# EAGLE schematic PowerBoard (EAGLE 5.11)
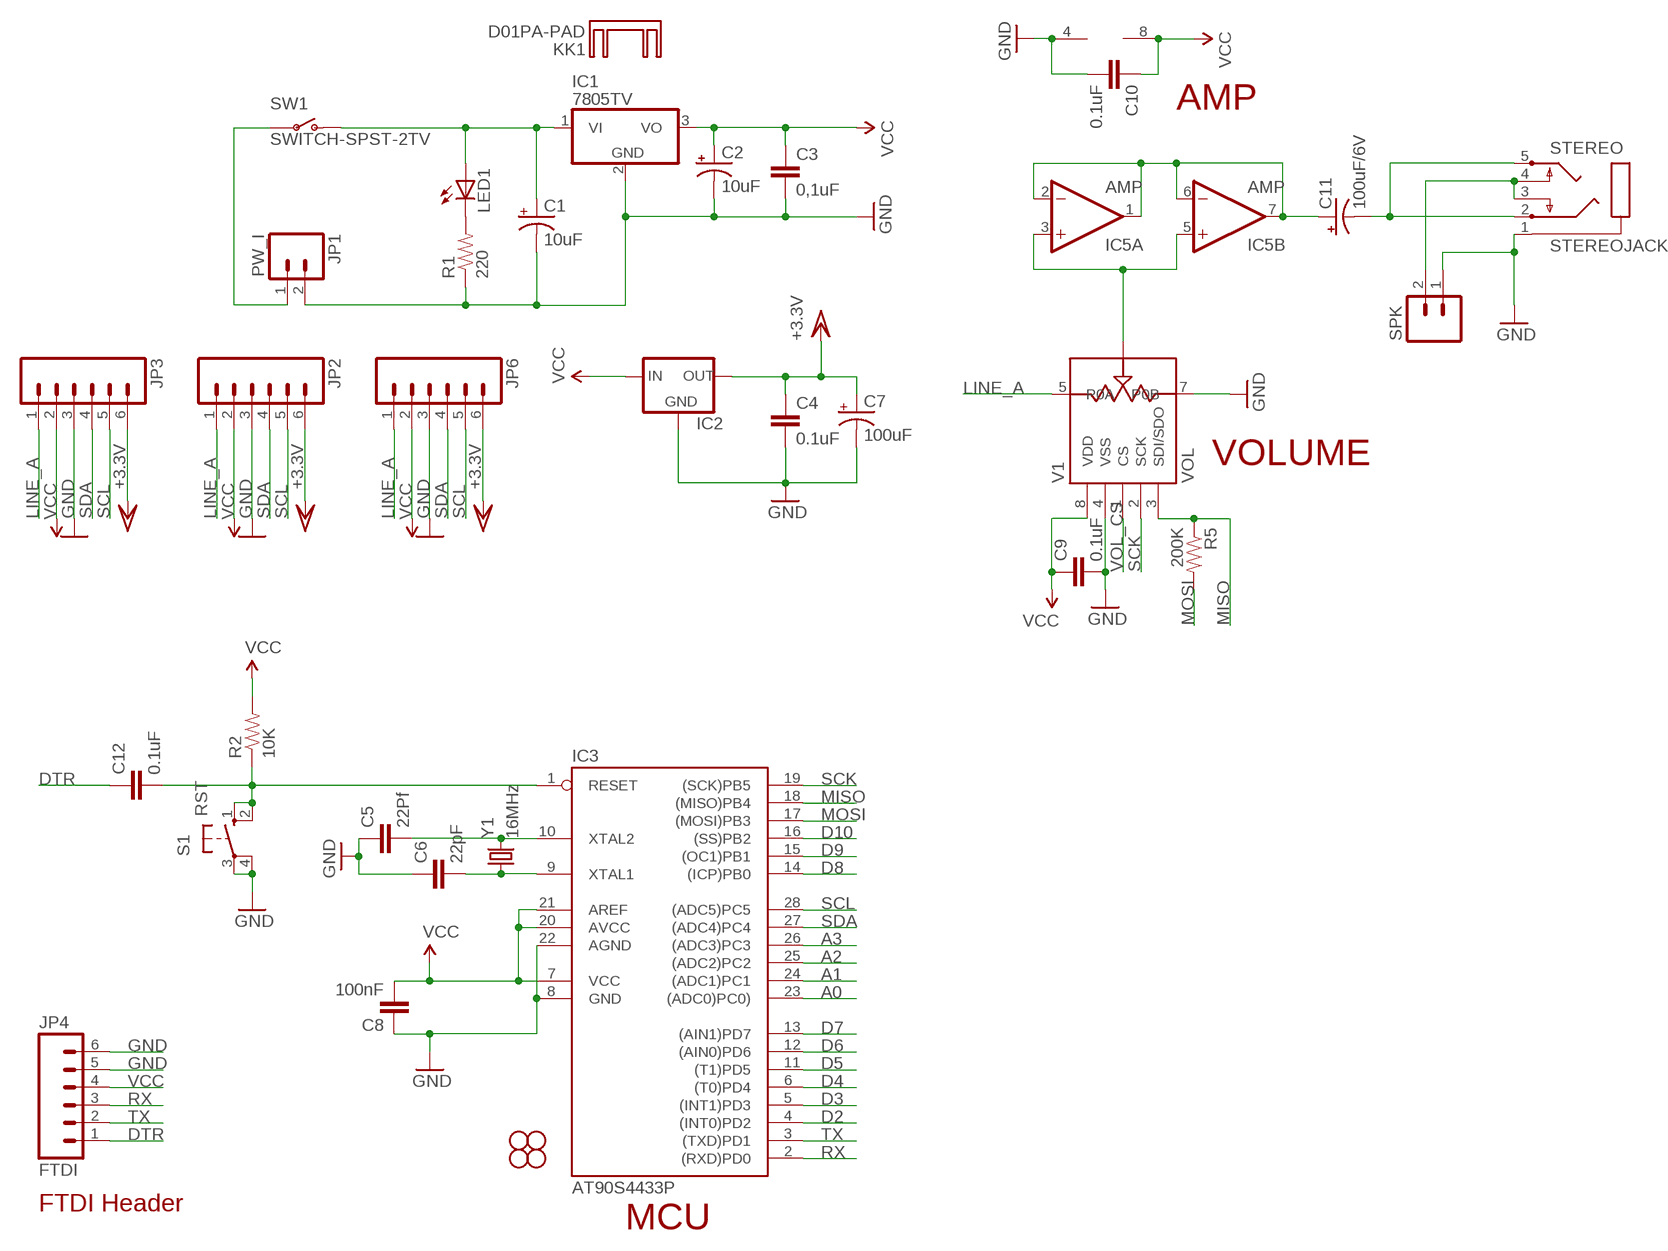
[diagram p0: schematic, sheet 1]

## Parts
C1  10uF  CAP_POLPTH2  [CPOL-RADIAL-10UF-25V]
C2  10uF  CAP_POLPTH2  [CPOL-RADIAL-10UF-25V]
C3  0,1uF  CAPPTH  [CAP-PTH-SMALL]
C4  0.1uF  CAPPTH  [CAP-PTH-SMALL]
C5  22Pf  CAPPTH  [CAP-PTH-SMALL]
C6  22pF  CAPPTH  [CAP-PTH-SMALL]
C7  100uF  CAP_POLPTH1  [CPOL-RADIAL-100UF-25V]
C8  100nF  CAPPTH  [CAP-PTH-SMALL]
C9  0.1uF  CAPPTH  [CAP-PTH-SMALL]
C10  0.1uF  CAPPTH  [CAP-PTH-SMALL]
C11  100uF/6V  CAP_POLPTH2  [CPOL-RADIAL-10UF-25V]
C12  0.1uF  CAPPTH  [CAP-PTH-SMALL]
IC1  7805TV  [TO220V]
IC2  MCP1700INLINE  [TO92-INLINE]
IC3  AT90S4433P  [DIL28-3]
IC5  AMP  TL072P  [DIL08]
JP1  PW_I  M02POLAR_LOCK  [MOLEX-1X2_LOCK]
JP2  M06POLAR_LOCK  [MOLEX-1X6_LOCK]
JP3  M06POLAR_LOCK  [MOLEX-1X6_LOCK]
JP4  FTDI  M06LOCK  [1X06_LOCK]
JP5  STAND-OFF  [STAND-OFF]
JP6  M06POLAR_LOCK  [MOLEX-1X6_LOCK]
JP7  STAND-OFF  [STAND-OFF]
JP8  STAND-OFF  [STAND-OFF]
JP9  STAND-OFF  [STAND-OFF]
KK1  D01PA-PAD  [D01PA-PAD]
LED1  LED5MM  [LED5MM]
R1  220  RESISTORPTH-1/4W  [AXIAL-0.4]
R2  10K  RESISTORPTH-1/4W  [AXIAL-0.4]
R5  200K  RESISTORPTH-1/4W  [AXIAL-0.4]
S1  RST  10-XX  [B3F-10XX]
SPK  M02POLAR  [MOLEX-1X2]
STEREO  STEREOJACK  [STX3100]
SW1  SWITCH-SPST-2TV  [SWITCH-SPST-VERTICAL]
V1  VOL  MCP416110E/P  [DIL08]
Y1  16MHz  CRYSTALHC49US  [HC49US]

## Nets
A0: IC3.23((ADC0)PC0))
A1: IC3.24((ADC1)PC1)
A2: IC3.25((ADC2)PC2)
A3: IC3.26((ADC3)PC3)
D2: IC3.4((INT0)PD2)
D3: IC3.5((INT1)PD3)
D4: IC3.6((T0)PD4)
D5: IC3.11((T1)PD5)
D6: IC3.12((AIN0)PD6)
D7: IC3.13((AIN1)PD7)
D8: IC3.14((ICP)PB0)
D9: IC3.15((OC1)PB1)
D10: IC3.16((SS)PB2)
DTR: C12.1 JP4.1
GND: C1.2(-) C2.2(-) C3.2 C4.2 C5.1 C6.1 C7.2(-) C8.1 C9.2 C10.2 IC1.2(GND) IC2.1(GND) IC3.8(GND) IC3.22(AGND) IC5.4(P:V-) JP1.2 JP2.3 JP3.3 JP4.5 JP4.6 JP6.3 R1.P$1 S1.3(P) S1.4(P1) SPK.1 STEREO.1 V1.4(VSS) V1.7(P0B)
LINE_A: JP2.1 JP3.1 JP6.1 V1.5(P0A)
MISO: IC3.18((MISO)PB4) R5.P$1 V1.3(SDI/SDO)
MOSI: IC3.17((MOSI)PB3) R5.P$2
N$1: IC5.3(A:+IN) IC5.5(B:+IN) V1.6(P0W)
N$2: C12.2 IC3.1(RESET) R2.P$1 S1.1(S) S1.2(S1)
N$3: JP1.1 SW1.2(P)
N$4: C1.1(+) IC1.1(VI) LED1.A SW1.1(O)
N$5: SPK.2 STEREO.3 STEREO.4
N$6: LED1.K(C) R1.P$2
N$8: C11.2(-) STEREO.2 STEREO.5
N$9: C11.1(+) IC5.1(A:OUT) IC5.2(A:-IN) IC5.6(B:-IN) IC5.7(B:OUT)
RX: IC3.2((RXD)PD0) JP4.3
SCK: IC3.19((SCK)PB5) V1.2(SCK)
SCL: IC3.28((ADC5)PC5) JP2.5 JP3.5 JP6.5
SDA: IC3.27((ADC4)PC4) JP2.4 JP3.4 JP6.4
TX: IC3.3((TXD)PD1) JP4.2
VCC: C2.1(+) C3.1 C8.2 C9.1 C10.1 IC1.3(VO) IC2.2(IN) IC3.7(VCC) IC3.20(AVCC) IC3.21(AREF) IC5.8(P:V+) JP2.2 JP3.2 JP4.4 JP6.2 R2.P$2 V1.8(VDD)
VCC/2: C4.1 C7.1(+) IC2.3(OUT) JP2.6 JP3.6 JP6.6 ; supply symbol labelled +3.3V
VOL_CS: V1.1(CS)
XTAL1: C6.2 IC3.9(XTAL1) Y1.1
XTAL2: C5.2 IC3.10(XTAL2) Y1.2

## Notes on the sheet
- AMP
- VOLUME
- FTDI Header
- MCU

## Library data of the parts
C1 C2 C7 C11 = SparkFun:CAP_POL: Capacitor Polarized These are standard SMD and PTH capacitors. Normally 10uF, 47uF, and 100uF in electrolytic and tantalum varieties. Always verify the external diameter of the through hole cap, it varies with capacity, voltage, and manufacturer. The EIA devices should be standard.
C3-C6 C8-C10 C12 = SparkFun:CAP: Capacitor Standard 0603 ceramic capacitor, and 0.1" leaded capacitor.
IC1 = linear:78*: Positive VOLTAGE REGULATOR Source: http://cache.national.com/ds/LM/LM78L05.pdf http://www.fairchildsemi.com/ds/LM/LM7805.pdf
IC2 = adafruit:MCP1700: VOLTAGE REGULATOR
IC3 = atmel:AT90S4433: MICROCONTROLLER 4 Kbytes FLASH 128 bytes SRAM 256 bytes EEPROM UART 6-channel 10 bit ADC; OC_FARNELL: unknown; OC_NEWARK: unknown
IC5 = linear:TL072: OP AMP
JP1 SPK = SparkFun:M02: Header 2 Standard 2-pin 0.1" header. Use with straight break away headers (SKU : PRT-00116), right angle break away headers (PRT-00553), swiss pins (PRT-00743), machine pins (PRT-00117), and female headers (PRT-00115). Molex polarized connector foot print use with SKU : PRT-08233 with associated crimp pins and housings.
JP2-JP4 JP6 = SparkFun:M06: Header 6 Standard 6-pin 0.1" header. Use with straight break away headers (SKU : PRT-00116), right angle break away headers (PRT-00553), swiss pins (PRT-00743), machine pins (PRT-00117), and female headers (PRT-00115). Molex polarized connector foot print use with SKU : PRT-08094 with associated crimp pins and housings. NOTES ON THE VARIANTS LOCK and LOCK_LONGPADS... This footprint was designed to help hold the alignment of a through-hole component (i.e. 6-pin header) while soldering it into place. You may notice that each hole has been shifted either up or down by 0.005 of an inch from it's more standard position (which is a perfectly straight line). This slight alteration caused the pins (the squares in the middle) to touch the edges of the holes. Because they are alternating, it causes a "brace" to hold the component in place. 0.005 has proven to be the perfect amount of "off-center" position when using our standard breakaway headers. Although looks a little odd when you look at the bare footprint, once you have a header in there, the alteration is very hard to notice. Also, if you push a header all the way into place, it is covered up entirely on the bottom side. This idea of altering the position of holes to aid alignment will be further integrated into the Sparkfun Library for other footprints. It can help hold any component with 3 or more connection pins.
JP5 JP7-JP9 = SparkFun:STAND-OFF: Stand Off This is the mechanical footprint for a #4 phillips button head screw. Use the keepout ring to avoid running the screw head into surrounding components. SKU : PRT-00447
KK1 = heatsink:D01PA-PAD: HEATSINK distributor Schukat
LED1 = SparkFun:LED: LEDs Standard schematic elements and footprints for 5mm, 3mm, 1206, and 0603 sized LEDs. 5mm - Spark Fun Electronics SKU : COM-00529 (and others)
R1 R2 R5 = SparkFun:RESISTOR: Resistor Basic schematic elements and footprints for 0603, 1206, and PTH resistors.
S1 = switch-omron:10-XX: OMRON SWITCH; MPN: B3F-1000; OC_FARNELL: 176432; OC_NEWARK: 36M3542
STEREO = adafruit:STEREOJACK: MIC/HEADPHONE JACK Stereo jack with two switches. Kycon STX3100, CUI SJ1-3555NG and/or 4UCon 05544
SW1 = SparkFun:SWITCH-SPST-2
V1 = Dek:MCP4161
Y1 = SparkFun:CRYSTAL: Crystals Various standard crystals. Proven footprints. Spark Fun Electronics SKU : COM-00534